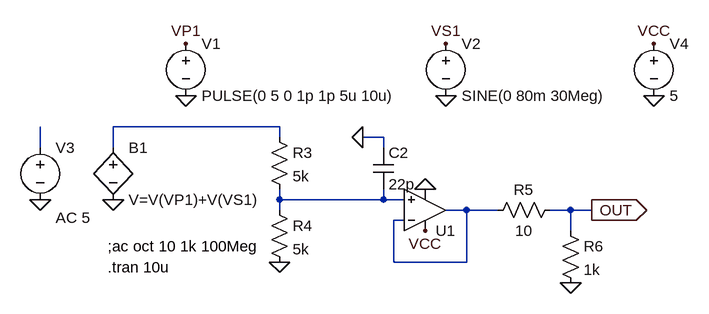
[diagram p0: schematic SQR_FG_C_Bypass.asc]
SQR_FG_C_Bypass.asc, the LTspice schematic file:
Version 4
SHEET 1 880 680
WIRE -96 -32 -352 -32
WIRE -96 -16 -96 -32
WIRE 64 -16 32 -16
WIRE -464 0 -464 -32
WIRE -352 0 -352 -32
WIRE 64 0 64 -16
WIRE -96 80 -96 64
WIRE 64 80 64 64
WIRE 64 80 -96 80
WIRE 96 80 64 80
WIRE -96 96 -96 80
WIRE 192 96 160 96
WIRE 240 96 192 96
WIRE 352 96 320 96
WIRE 384 96 352 96
WIRE 96 112 80 112
WIRE 352 128 352 96
WIRE 80 176 80 112
WIRE 192 176 192 96
WIRE 192 176 80 176
FLAG -96 176 0
FLAG 32 -16 0
FLAG 384 96 OUT
IOPIN 384 96 Out
FLAG -352 80 0
FLAG -240 -80 0
FLAG -240 -160 VP1
FLAG 160 -160 VS1
FLAG 160 -80 0
FLAG -464 80 0
FLAG 352 208 0
FLAG 480 -160 VCC
FLAG 480 -80 0
FLAG 128 128 VCC
FLAG 128 64 0
SYMBOL Opamps\\UniversalOpamp2 128 96 M180
SYMATTR InstName U1
SYMBOL res -112 -32 R0
SYMATTR InstName R3
SYMATTR Value 5k
SYMBOL res -112 80 R0
SYMATTR InstName R4
SYMATTR Value 5k
SYMBOL cap 48 0 R0
SYMATTR InstName C2
SYMATTR Value 22p
SYMBOL res 336 80 R90
WINDOW 0 0 56 VBottom 2
WINDOW 3 32 56 VTop 2
SYMATTR InstName R5
SYMATTR Value 10
SYMBOL bv -352 -16 R0
SYMATTR InstName B1
SYMATTR Value V=V(VP1)+V(VS1)
SYMBOL voltage -240 -176 R0
WINDOW 123 0 0 Left 2
WINDOW 39 0 0 Left 2
SYMATTR InstName V1
SYMATTR Value PULSE(0 5 0 1p 1p 5u 10u)
SYMBOL voltage 160 -176 R0
WINDOW 123 0 0 Left 2
WINDOW 39 0 0 Left 2
SYMATTR InstName V2
SYMATTR Value SINE(0 80m 30Meg)
SYMBOL voltage -464 -16 R0
WINDOW 123 24 124 Left 2
WINDOW 39 0 0 Left 2
SYMATTR InstName V3
SYMATTR Value ""
SYMATTR Value2 AC 5
SYMBOL res 336 112 R0
SYMATTR InstName R6
SYMATTR Value 1k
SYMBOL voltage 480 -176 R0
WINDOW 123 0 0 Left 2
WINDOW 39 0 0 Left 2
SYMATTR InstName V4
SYMATTR Value 5
TEXT -360 184 Left 2 !.tran 10u
TEXT -360 152 Left 2 !;ac oct 10 1k 100Meg

The netlist it stands for:
* SQR_FG_C_Bypass.asc
XU1 N003 N004 VCC 0 N004 level.2 Avol=1Meg GBW=10Meg Slew=10Meg ilimit=25m rail=0 Vos=0 phimargin=45 en=0 enk=0 in=0 ink=0 Rin=500Meg  ; pins IN+ IN- V+ V- OUT
R3 N001 N003 5k
R4 N003 0 5k
C2 0 N003 22p
R5 OUT N004 10
B1 N001 0 V=V(VP1)+V(VS1)
V1 VP1 0 PULSE(0 5 0 1p 1p 5u 10u)
V2 VS1 0 SINE(0 80m 30Meg)
V3 N002 0 AC 5
R6 OUT 0 1k
V4 VCC 0 5
.tran 10u
;ac oct 10 1k 100Meg
.lib UniversalOpamps2.sub
.backanno
.end